# EAGLE design communication (EAGLE 6.1)
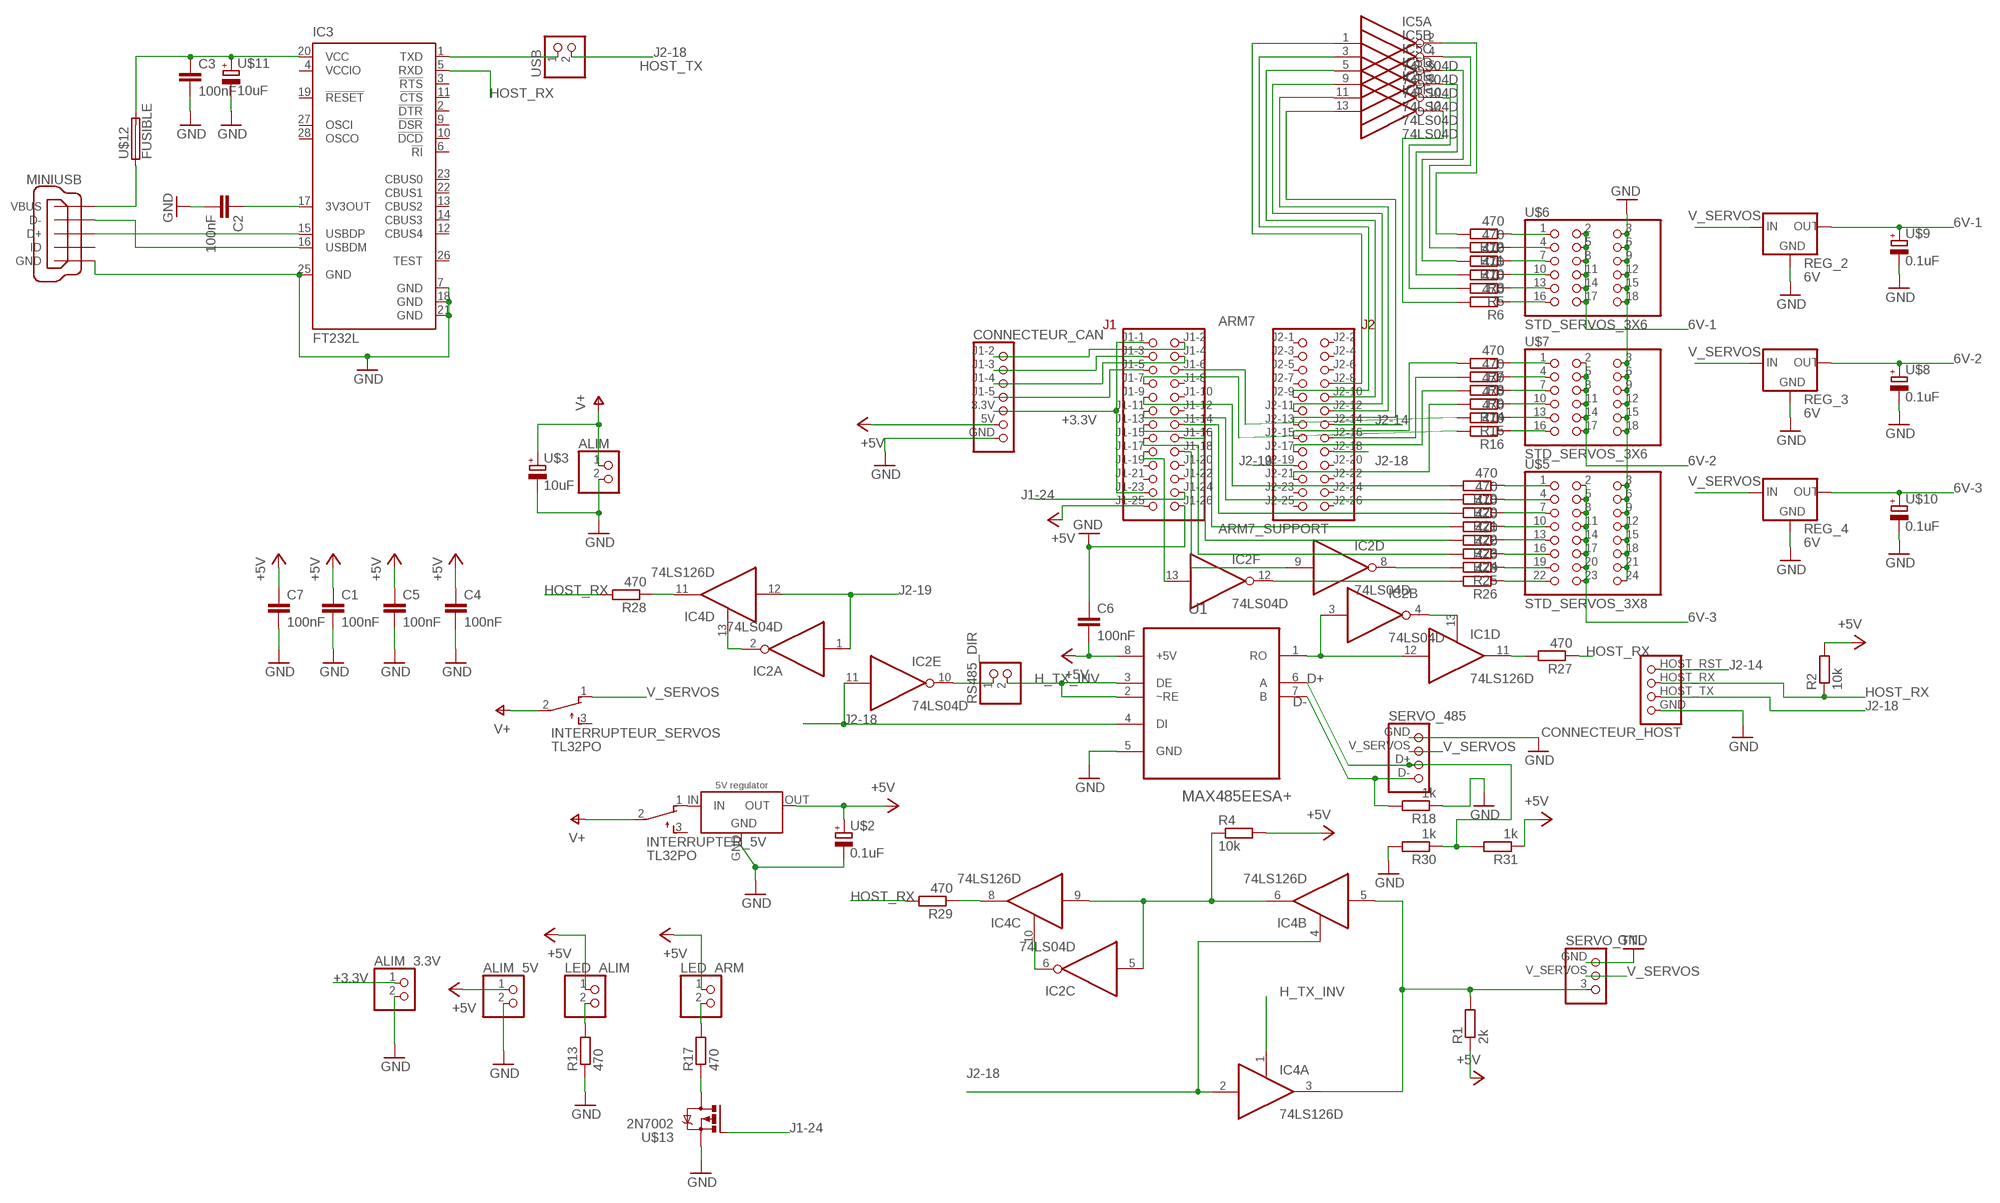
[diagram p0: schematic, sheet 1]

## Parts
ALIM  CONNEC_1X02  [CONNEC_1X02]
ALIM_3.3V  CONNEC_1X02  [CONNEC_1X02]
ALIM_5V  CONNEC_1X02  [CONNEC_1X02]
ARM7  ARM7_SUPPORT  [ARM7_SUPPORT]
C1  100nF  C_EU_1210  [C1210]
C2  100nF  C_EU_1210  [C1210]
C3  100nF  C_EU_1210  [C1210]
C4  100nF  C_EU_1210  [C1210]
C5  100nF  C_EU_1210  [C1210]
C6  100nF  C_EU_1210  [C1210]
C7  100nF  C_EU_1210  [C1210]
CONNECTEUR_CAN  CONNECTEUR_CAN  [CONNECTEUR_CAN]
CONNECTEUR_HOST  CONNECTEUR_HOST  [CONNECTEUR_HOST]
IC1  74LS126D  [SO14]
IC2  74LS04D  [SO14]
IC3  FT232L  [SSOP28]
IC4  74LS126D  [SO14]
IC5  74LS04D  [SO14]
INTERRUPTER_5V  TL32PO  [TL3XPO]
INTERRUPTEUR_SERVOS  TL32PO  [TL3XPO]
LED_ALIM  CONNEC_1X02  [CONNEC_1X02]
LED_ARM  CONNEC_1X02  [CONNEC_1X02]
MINIUSB  MINIUSB  [MINI_USB]
R1  2k  R-EU_R0805  [R0805]
R2  10k  R-EU_R0805  [R0805]
R3  470  R-EU_R0805  [R0805]
R4  10k  R-EU_R0805  [R0805]
R5  470  R-EU_R0805  [R0805]
R6  470  R-EU_R0805  [R0805]
R7  470  R-EU_R0805  [R0805]
R8  470  R-EU_R0805  [R0805]
R9  470  R-EU_R0805  [R0805]
R10  470  R-EU_R0805  [R0805]
R11  470  R-EU_R0805  [R0805]
R12  470  R-EU_R0805  [R0805]
R13  470  R-EU_R0805  [R0805]
R14  470  R-EU_R0805  [R0805]
R15  470  R-EU_R0805  [R0805]
R16  470  R-EU_R0805  [R0805]
R17  470  R-EU_R0805  [R0805]
R18  1k  R-EU_R0805  [R0805]
R19  470  R-EU_R0805  [R0805]
R20  470  R-EU_R0805  [R0805]
R21  470  R-EU_R0805  [R0805]
R22  470  R-EU_R0805  [R0805]
R23  470  R-EU_R0805  [R0805]
R24  470  R-EU_R0805  [R0805]
R25  470  R-EU_R0805  [R0805]
R26  470  R-EU_R0805  [R0805]
R27  470  R-EU_R0805  [R0805]
R28  470  R-EU_R0805  [R0805]
R29  470  R-EU_R0805  [R0805]
R30  1k  R-EU_R0805  [R0805]
R31  1k  R-EU_R0805  [R0805]
REG_2  6V  78XXL  [78XXL]
REG_3  6V  78XXL  [78XXL]
REG_4  6V  78XXL  [78XXL]
RS485_DIR  CONNEC_1X02  [CONNEC_1X02]
SERVO_485  CONNECTEUR_485  [CONNECTEUR_485]
SERVO_TTL  CONNECTEUR_TTL  [CONNECTEUR_TTL]
U1  MAX485EESA+  [SOIC127P600X175-8N]
U$2  0.1uF  CPOL_EUCPOL_EU_2.54-6  [E2,5-6]
U$3  10uF  CPOL_EUCPOL_EU_5-10,5  [E5-10,5]
U$5  STD_SERVOS_3X8  [STD_SERVOS_3X8]
U$6  STD_SERVOS_3X6  [STD_SERVOS_3X6]
U$7  STD_SERVOS_3X6  [STD_SERVOS_3X6]
U$8  0.1uF  CPOL_EUCPOL_EU_2.54-6  [E2,5-6]
U$9  0.1uF  CPOL_EUCPOL_EU_2.54-6  [E2,5-6]
U$10  0.1uF  CPOL_EUCPOL_EU_2.54-6  [E2,5-6]
U$11  10uF  CPOL_EUCPOL_EU_5-10,5  [E5-10,5]
U$12  FUSIBLE  [FUSIBLE]
U$13  2N7002  [SOT23]
U$14  5V regulator  REGULATEUR_CMS  [REGULATEUR_CMS]
USB  CONNEC_1X02  [CONNEC_1X02]

## Nets
6V-1: REG_2.OUT U$6.2 U$6.5 U$6.8 U$6.11 U$6.14 U$6.17 U$9.+
6V-2: REG_3.OUT U$7.2 U$7.5 U$7.8 U$7.11 U$7.14 U$7.17 U$8.+
6V-3: REG_4.OUT U$5.2 U$5.5 U$5.8 U$5.11 U$5.14 U$5.17 U$5.20 U$5.23 U$10.+
+3.3V: ALIM_3.3V.1 ARM7.J1-1 ARM7.J1-23 CONNECTEUR_CAN.3.3V
+5V: ALIM_5V.1 ARM7.J1-25 C1.1 C4.1 C5.1 C6.2 C7.1 CONNECTEUR_CAN.5V LED_ALIM.1 LED_ARM.1 R1.1 R2.2 R4.2 R31.1 U1.8(+5V) U$2.+ U$14.OUT
ALIM_USB: C3.1 IC3.20(VCC) U$11.+ U$12.P$2
B$1: ARM7.J2-8 IC5.1(A:I)
B$2: ARM7.J2-9 IC5.3(B:I)
B$3: ARM7.J2-10 IC5.5(C:I)
B$4: ARM7.J2-11 IC5.9(D:I)
B$5: ARM7.J2-12 IC5.11(E:I)
B$6: ARM7.J2-13 IC5.13(F:I)
B$7: ARM7.J2-15 R7.2
B$8: ARM7.J2-16 R8.2
B$9: ARM7.J2-17 R9.2
B$10: ARM7.J2-21 R14.2
B$11: ARM7.J1-6 R15.2
B$12: ARM7.J1-7 R16.2
D+: R30.1 R31.2 SERVO_485.D+ U1.6(A)
D-: R18.2 SERVO_485.D- U1.7(B)
GND: ALIM.2 ALIM_3.3V.2 ALIM_5V.2 ARM7.J1-26 C1.2 C2.2 C3.2 C4.2 C5.2 C6.1 C7.2 CONNECTEUR_CAN.GND CONNECTEUR_HOST.GND IC3.7(GND) IC3.18(GND) IC3.21(GND) IC3.25(GND) MINIUSB.GND R13.1 R18.1 R30.2 REG_2.GND REG_3.GND REG_4.GND SERVO_485.GND SERVO_TTL.GND U1.5(GND) U$2.- U$3.- U$5.3 U$5.6 U$5.9 U$5.12 U$5.15 U$5.18 U$5.21 U$5.24 U$6.3 U$6.6 U$6.9 U$6.12 U$6.15 U$6.18 U$7.3 U$7.6 U$7.9 U$7.12 U$7.15 U$7.18 U$8.- U$9.- U$10.- U$11.- U$13.2(S) U$14.GND
H_TX_INV: IC4.1(A:OE) RS485_DIR.2 U1.2(~RE) U1.3(DE)
HOST_RX: CONNECTEUR_HOST.HOST_RX IC3.5(RXD) R2.1 R27.1 R28.2 R29.2
J1-2: ARM7.J1-2 CONNECTEUR_CAN.J1-2
J1-3: ARM7.J1-3 CONNECTEUR_CAN.J1-3
J1-4: ARM7.J1-4 CONNECTEUR_CAN.J1-4
J1-5: ARM7.J1-5 CONNECTEUR_CAN.J1-5
J1-24: ARM7.J1-24 U$13.1(G)
J2-14: ARM7.J2-14 CONNECTEUR_HOST.HOST_RST
J2-18: ARM7.J2-18 CONNECTEUR_HOST.HOST_TX IC2.11(E:I) IC4.2(A:I) IC4.4(B:OE) U1.4(DI) USB.2
J2-19: ARM7.J2-19 IC2.1(A:I) IC4.12(D:I)
N$1: IC2.6(C:O) IC4.10(C:OE)
N$2: IC2.5(C:I) IC4.6(B:O) IC4.9(C:I) R4.1
N$3: INTERRUPTER_5V.1(O) U$14.IN
N$4: IC2.8(D:O) R25.2
N$5: IC4.3(A:O) IC4.5(B:I) R1.2 SERVO_TTL.3
N$6: LED_ALIM.2 R13.2
N$7: IC1.12(D:I) IC2.3(B:I) U1.1(RO)
N$8: IC2.12(F:O) R26.2
N$9: R17.1 U$13.3(D)
N$10: LED_ARM.2 R17.2
N$11: IC3.1(TXD) USB.1
N$12: IC1.13(D:OE) IC2.4(B:O)
N$13: ARM7.J1-9 R19.2
N$14: MINIUSB.VBUS U$12.P$1
N$15: IC2.2(A:O) IC4.13(D:OE)
N$16: R12.1 U$6.1
N$17: R11.1 U$6.4
N$18: R10.1 U$6.7
N$19: R3.1 U$6.10
N$20: R5.1 U$6.13
N$21: R6.1 U$6.16
N$22: R7.1 U$7.1
N$23: R8.1 U$7.4
N$24: R9.1 U$7.7
N$25: R14.1 U$7.10
N$26: R15.1 U$7.13
N$27: R16.1 U$7.16
N$28: ARM7.J1-11 R20.2
N$29: ARM7.J1-13 R22.2
N$30: ARM7.J1-14 R21.2
N$31: ARM7.J1-16 R23.2
N$32: ARM7.J1-15 R24.2
N$33: ARM7.J1-18 IC2.9(D:I)
N$34: ARM7.J1-17 IC2.13(F:I)
N$35: R19.1 U$5.1
N$36: R20.1 U$5.4
N$37: R21.1 U$5.7
N$38: R22.1 U$5.10
N$39: R23.1 U$5.13
N$40: R24.1 U$5.16
N$41: R25.1 U$5.19
N$42: R26.1 U$5.22
N$43: IC2.10(E:O) RS485_DIR.1
N$44: C2.1 IC3.17(3V3OUT)
N$45: IC3.15(USBDP) MINIUSB.D+
N$46: IC3.16(USBDM) MINIUSB.D-
N$49: IC5.12(F:O) R6.2
N$50: IC5.10(E:O) R5.2
N$51: IC5.8(D:O) R3.2
N$52: IC5.6(C:O) R10.2
N$53: IC5.4(B:O) R11.2
N$54: IC5.2(A:O) R12.2
TO_RX-1: IC1.11(D:O) R27.2
TO_RX-2: IC4.8(C:O) R29.1
TO_RX-3: IC4.11(D:O) R28.1
V+: ALIM.1 INTERRUPTER_5V.2(P) INTERRUPTEUR_SERVOS.2(P) U$3.+
V_SERVOS: INTERRUPTEUR_SERVOS.1(O) REG_2.IN REG_3.IN REG_4.IN SERVO_485.V_SERVOS SERVO_TTL.V_SERVOS
Unconnected: ARM7.J1-8 ARM7.J1-10 ARM7.J1-12 ARM7.J1-19 ARM7.J1-20 ARM7.J1-21 ARM7.J1-22 ARM7.J2-1 ARM7.J2-2 ARM7.J2-3 ARM7.J2-4 ARM7.J2-5 ARM7.J2-6 ARM7.J2-7 ARM7.J2-20 ARM7.J2-22 ARM7.J2-23 ARM7.J2-24 ARM7.J2-25 ARM7.J2-26 IC1.1(A:OE) IC1.2(A:I) IC1.3(A:O) IC1.4(B:OE) IC1.5(B:I) IC1.6(B:O) IC1.8(C:O) IC1.9(C:I) IC1.10(C:OE) IC3.2(!DTR) IC3.3(!RTS) IC3.6(!RI) IC3.9(!DSR) IC3.10(!DCD) IC3.11(!CTS) IC3.12(CBUS4) IC3.13(CBUS2) IC3.14(CBUS3) IC3.19(!RESET) IC3.22(CBUS1) IC3.23(CBUS0) IC3.26(TEST) IC3.27(OSCI) IC3.28(OSCO) INTERRUPTER_5V.3(S) INTERRUPTEUR_SERVOS.3(S) MINIUSB.ID

## Notes on the sheet
- HOST_TX

## Power pins joined to a net without a drawn wire
+5V: IC1.14(P:+5V) IC2.14(P:+5V) IC4.14(P:+5V) IC5.14(P:+5V)
GND: IC1.7(P:GND) IC2.7(P:GND) IC4.7(P:GND) IC5.7(P:GND) U$14.GND2(GND)
VCCIO: IC3.4(VCCIO)

## Library data of the parts
ALIM ALIM_3.3V ALIM_5V LED_ALIM LED_ARM RS485_DIR USB = rhoban:CONNEC_1X02
ARM7 = rhoban:ARM7_SUPPORT: The support used for the ARM7
C1-C7 = rhoban:C_EU_1210
CONNECTEUR_CAN = rhoban:CONNECTEUR_CAN
CONNECTEUR_HOST = rhoban:CONNECTEUR_HOST
IC1 IC4 = rhoban:74*126: Quad bus BUFFER, 3-state
IC2 IC5 = rhoban:74*04: Hex INVERTER
IC3 = rhoban:FT232: Source: http://www.ftdichip.com/Documents/DataSheets/DS_FT232R_v104.pdf; MPN: FT232RL; OC_FARNELL: 1146032; OC_NEWARK: 91K9918
INTERRUPTER_5V INTERRUPTEUR_SERVOS = rhoban:TL32PO
MINIUSB = rhoban:MINIUSB
R1-R31 = rhoban:R-EU_: RESISTOR, European symbol
REG_2-REG_4 = rhoban:78XXL: Régulateur de tension
SERVO_485 = rhoban:CONNECTEUR_485
SERVO_TTL = rhoban:CONNECTEUR_TTL
U1 = rhoban:MAX485EESA+; DESCRIPTION: ±15kV ESD-Protected, Slew-Rate-Limited, Low-Power, RS-485/RS-422 Transceivers; MPN: MAX485EESA+; OC_FARNELL: 1379973; OC_NEWARK: 68K4798; PACKAGE: SOIC-8; SUPPLIER: Maxim
U$2 U$3 U$8-U$11 = rhoban:CPOL_EU
U$5 = rhoban:STD_SERVOS_3X8
U$6 U$7 = rhoban:STD_SERVOS_3X6
U$12 = rhoban:FUSIBLE
U$13 = rhoban:2N7002
U$14 = rhoban:REGULATEUR_CMS

## Board
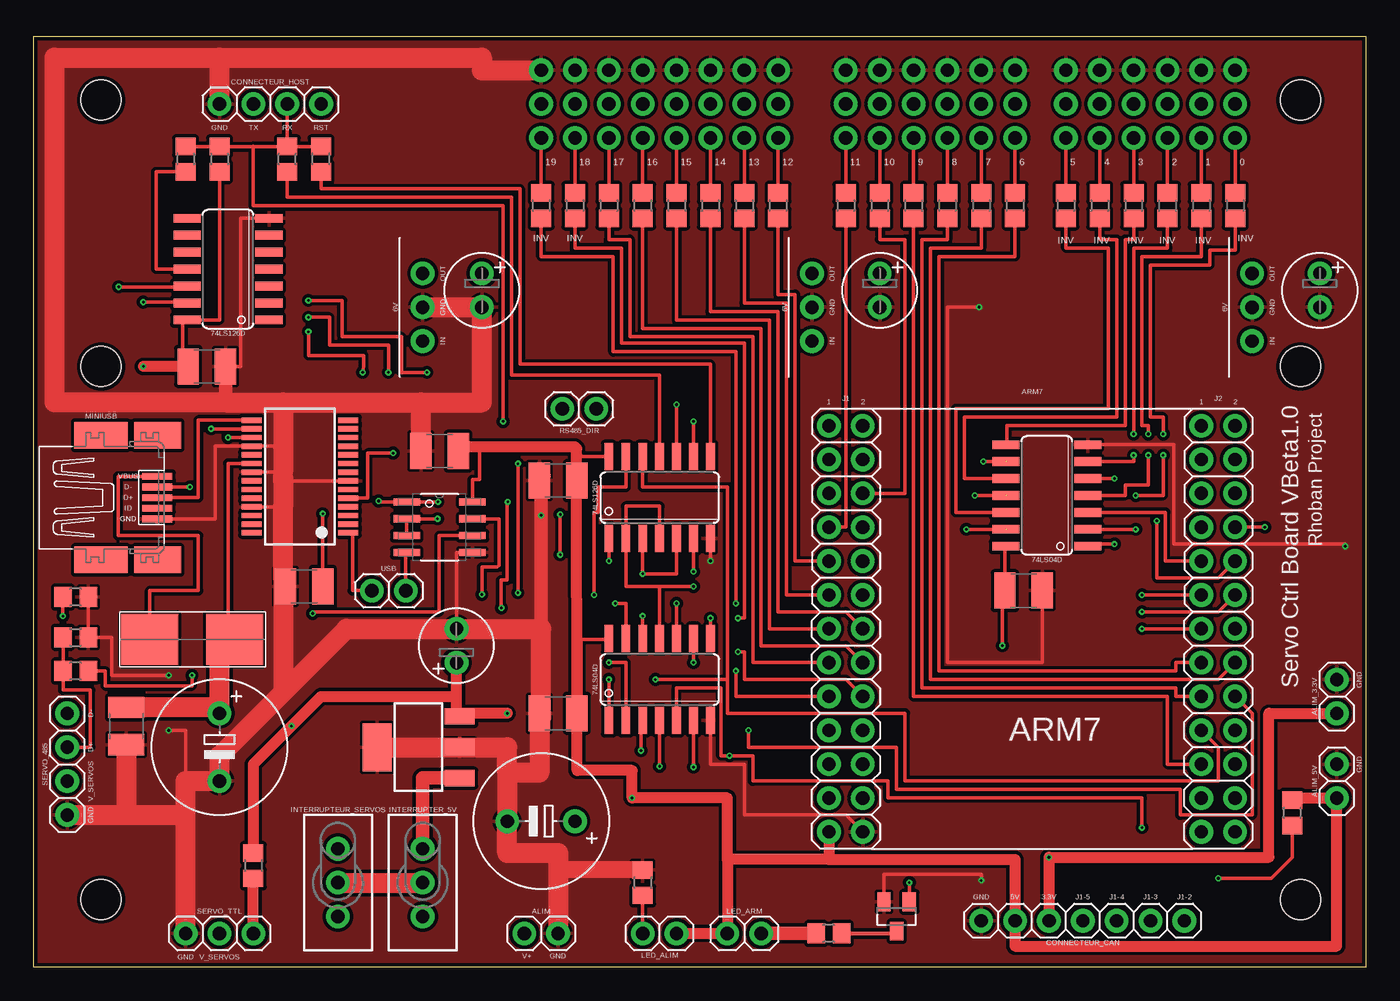
[diagram p1: board, top side]
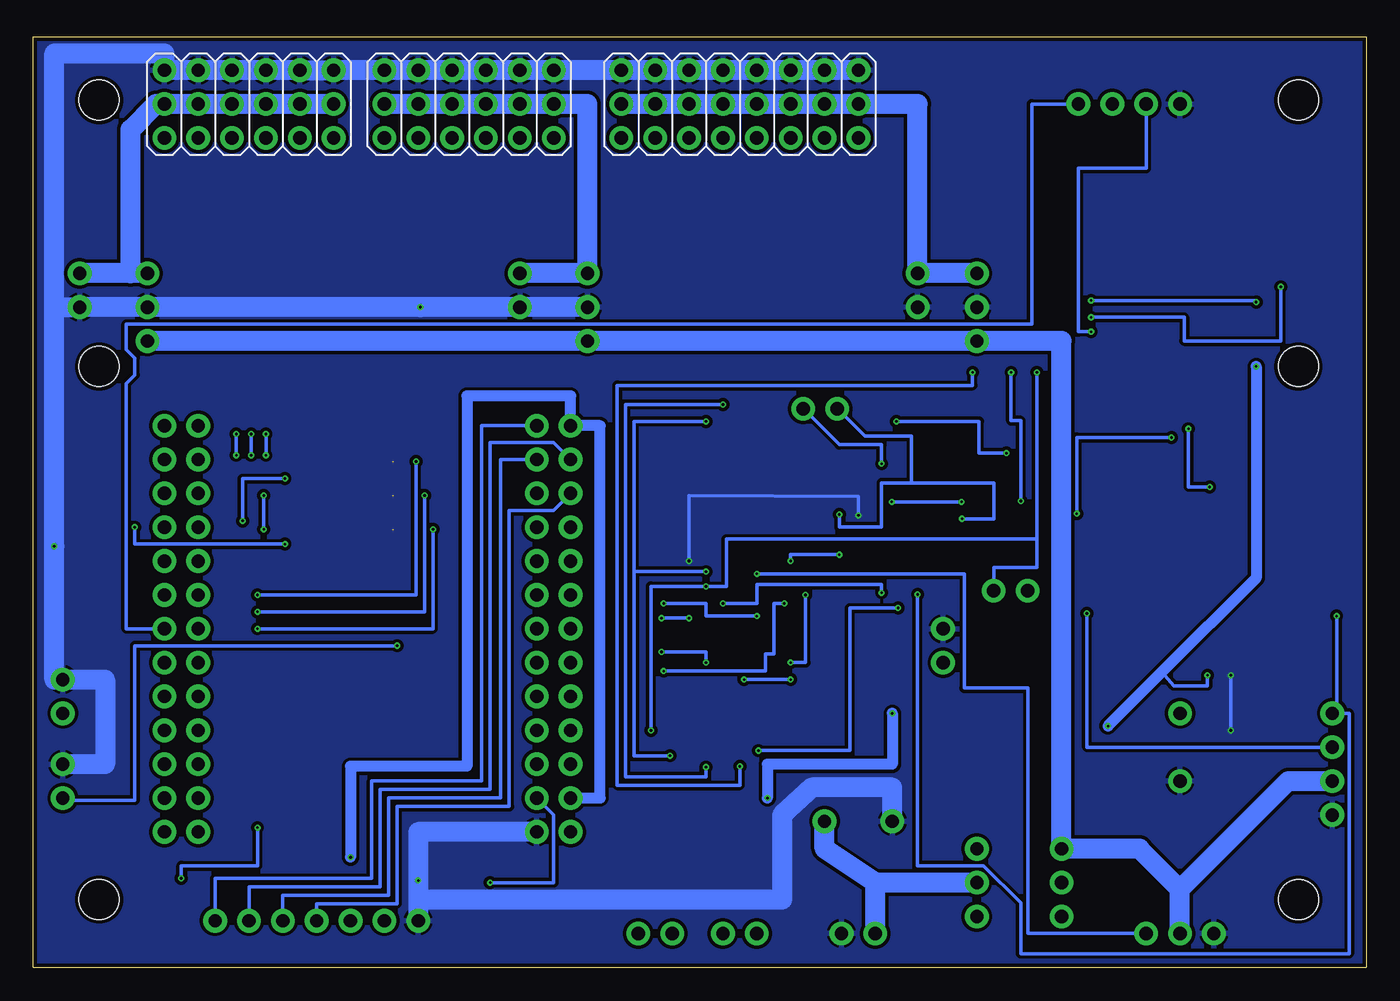
[diagram p2: board, bottom side, seen from below]

Size 100 x 69.85 mm. Coordinates in mm from the lower left corner, seen from the top.
Outline: 100,0.01 100,69.85 0,69.85 0,0.01
Outline: 100,0 0,0
Copper layers (1*16): Top 0.035mm / dielectric 1.5mm / Bottom 0.035mm
Design rules: minimum track width 0.125mm, minimum drill 0.2mm, track to track 0.125mm, track to pad 0.125mm, pad to pad 0.125mm, via to via 0.125mm, smd to smd 0.125mm, copper to edge 0.3mm, drill to drill 0.2mm, minimum pad ring 0.2mm, minimum via ring 0.125mm, stop-mask expansion 0.075mm, vias tented up to drill 0mil, thermal gap 0.2mm
Holes 3 mm at 5.08,5.09 95.07,5.09 5.08,45.09 95.07,45.09 5.08,65.08 95.07,65.08

### Footprints (pad centres in the part's own frame; a part is rotated, then mirrored left to right if it is on the bottom)
CONNEC_1X02 = drill 1 pad 1.778: 1 -1.27,1.27; 2 1.27,1.27
ARM7_SUPPORT = drill 1 pad 1.778: J1-1 1.27,1.27; J1-2 1.27,3.81; J1-3 3.81,1.27; J1-4 3.81,3.81; J1-5 6.35,1.27; J1-6 6.35,3.81; J1-7 8.89,1.27; J1-8 8.89,3.81; J1-9 11.43,1.27; J1-10 11.43,3.81; J1-11 13.97,1.27; J1-12 13.97,3.81; J1-13 16.51,1.27; J1-14 16.51,3.81; J1-15 19.05,1.27; J1-16 19.05,3.81; J1-17 21.59,1.27; J1-18 21.59,3.81; J1-19 24.13,1.27; J1-20 24.13,3.81; J1-21 26.67,1.27; J1-22 26.67,3.81; J1-23 29.21,1.27; J1-24 29.21,3.81; J1-25 31.75,1.27; J1-26 31.75,3.81; J2-1 1.27,29.21; J2-2 1.27,31.75; J2-3 3.81,29.21; J2-4 3.81,31.75; J2-5 6.35,29.21; J2-6 6.35,31.75; J2-7 8.89,29.21; J2-8 8.89,31.75; J2-9 11.43,29.21; J2-10 11.43,31.75; J2-11 13.97,29.21; J2-12 13.97,31.75; J2-13 16.51,29.21; J2-14 16.51,31.75; J2-15 19.05,29.21; J2-16 19.05,31.75; J2-17 21.59,29.21; J2-18 21.59,31.75; J2-19 24.13,29.21; J2-20 24.13,31.75; J2-21 26.67,29.21; J2-22 26.67,31.75; J2-23 29.21,29.21; J2-24 29.21,31.75; J2-25 31.75,29.21; J2-26 31.75,31.75
C1210 = smd 1.6 x 2.7: 1 -1.4,0; 2 1.4,0
CONNECTEUR_CAN = drill 1 pad 1.778: 3.3V 8.89,1.27; 5V 11.43,1.27; GND 13.97,1.27; J1-2 -1.27,1.27; J1-3 1.27,1.27; J1-4 3.81,1.27; J1-5 6.35,1.27
CONNECTEUR_HOST = drill 1 pad 1.778: GND -1.27,1.27; HOST_RST 6.35,1.27; HOST_RX 3.81,1.27; HOST_TX 1.27,1.27
SO14 = smd 0.66 x 2.032: 1 -3.81,-3.073; 2 -2.54,-3.073; 3 -1.27,-3.073; 4 0,-3.073; 5 1.27,-3.073; 6 2.54,-3.073; 7 3.81,-3.073; 8 3.81,3.073; 9 2.54,3.073; 10 1.27,3.073; 11 0,3.073; 12 -1.27,3.073; 13 -2.54,3.073; 14 -3.81,3.073
SSOP28 = smd 0.4 x 1.5: 1 -4.225,-3.625; 2 -3.575,-3.625; 3 -2.925,-3.625; 4 -2.275,-3.625; 5 -1.625,-3.625; 6 -0.975,-3.625; 7 -0.325,-3.625; 8 0.325,-3.625; 9 0.975,-3.625; 10 1.625,-3.625; 11 2.275,-3.625; 12 2.925,-3.625; 13 3.575,-3.625; 14 4.225,-3.625; 15 4.225,3.625; 16 3.575,3.625; 17 2.925,3.625; 18 2.275,3.625; 19 1.625,3.625; 20 0.975,3.625; 21 0.325,3.625; 22 -0.325,3.625; 23 -0.975,3.625; 24 -1.625,3.625; 25 -2.275,3.625; 26 -2.925,3.625; 27 -3.575,3.625; 28 -4.225,3.625
TL3XPO = drill 1 pad 1.778: 1 -1.27,0; 2 1.27,0; 3 3.81,0
MINI_USB = smd 2.25 x 0.5: D+ 4.225,0; D- 4.225,0.8; GND 4.225,-1.6; ID 4.225,-0.8; VBUS 4.225,1.6 | smd 4 x 2: M1 0,-4.671; M5 0,4.671 | smd 3.5 x 2: M3 4.25,4.671; M4 4.25,-4.671
R0805 = smd 1.3 x 1.5: 1 -0.95,0; 2 0.95,0
78XXL = drill 1 pad 1.778: GND 5.08,-2.54; IN 2.54,-2.54; OUT 7.62,-2.54
CONNECTEUR_485 = drill 1 pad 1.778: D+ 3.81,1.27; D- 6.35,1.27; GND -1.27,1.27; V_SERVOS 1.27,1.27
CONNECTEUR_TTL = drill 1 pad 1.778: 3 3.81,1.27; GND -1.27,1.27; V_SERVOS 1.27,1.27
SOIC127P600X175-8N = smd 1.981 x 0.533: 1 -2.464,1.905; 2 -2.464,0.635; 3 -2.464,-0.635; 4 -2.464,-1.905; 5 2.464,-1.905; 6 2.464,-0.635; 7 2.464,0.635; 8 2.464,1.905
E2,5-6 = drill 1 pad 1.778: + -1.27,0; - 1.27,0
E5-10,5 = drill 1 pad 1.778: + -2.54,0; - 2.54,0
STD_SERVOS_3X8 = drill 1 pad 1.778: 1 -8.89,-1.27; 2 -8.89,1.27; 3 -8.89,3.81; 4 -6.35,-1.27; 5 -6.35,1.27; 6 -6.35,3.81; 7 -3.81,-1.27; 8 -3.81,1.27; 9 -3.81,3.81; 10 -1.27,-1.27; 11 -1.27,1.27; 12 -1.27,3.81; 13 1.27,-1.27; 14 1.27,1.27; 15 1.27,3.81; 16 3.81,-1.27; 17 3.81,1.27; 18 3.81,3.81; 19 6.35,-1.27; 20 6.35,1.27; 21 6.35,3.81; 22 8.89,-1.27; 23 8.89,1.27; 24 8.89,3.81
STD_SERVOS_3X6 = drill 1 pad 1.778: 1 -6.35,-1.27; 2 -6.35,1.27; 3 -6.35,3.81; 4 -3.81,-1.27; 5 -3.81,1.27; 6 -3.81,3.81; 7 -1.27,-1.27; 8 -1.27,1.27; 9 -1.27,3.81; 10 1.27,-1.27; 11 1.27,1.27; 12 1.27,3.81; 13 3.81,-1.27; 14 3.81,1.27; 15 3.81,3.81; 16 6.35,-1.27; 17 6.35,1.27; 18 6.35,3.81
FUSIBLE = smd 4.242 x 3.81: P$1 0,0; P$2 6.375,0
SOT23 = smd 1 x 1.4: 1 -0.95,-1.1; 2 0.95,-1.1; 3 0,1.1
REGULATEUR_CMS = smd 1.219 x 2.235: GND 0,-3.099; IN -2.311,-3.099; OUT 2.311,-3.099 | smd 3.6 x 2.2: GND2 0,3.099

### Placement (x,y rotation side)
ALIM  38.1,1.28 0 top
ALIM_3.3V  99.06,20.33 90 top
ALIM_5V  99.06,13.98 90 top
ARM7  58.42,41.92 270 top
C1  13.02,45.09 0 top
C2  20.32,28.59 180 top
C3  6.99,18.11 270 top
C4  39.37,19.06 180 top
C5  39.37,36.52 180 top
C6  30.48,38.74 0 top
C7  74.3,28.27 0 top
CONNECTEUR_CAN  85.09,4.77 180 top
CONNECTEUR_HOST  15.24,63.51 0 top
IC1  14.61,52.4 90 top
IC2  46.99,21.6 0 top
IC3  20,36.84 90 top
IC4  46.99,35.25 0 top
IC5  76.04,35.41 90 top
INTERRUPTER_5V  29.21,7.63 270 top
INTERRUPTEUR_SERVOS  22.86,7.63 270 top
LED_ALIM  46.99,3.82 180 top
LED_ARM  53.34,1.28 0 top
MINIUSB  5.08,35.25 0 top
R1  16.51,7.63 270 top
R2  13.97,60.65 270 top
R3  82.55,57.16 270 top
R4  94.46,11.6 90 top
R5  80.01,57.16 270 top
R6  77.47,57.16 270 top
R7  73.66,57.16 270 top
R8  71.12,57.16 270 top
R9  68.58,57.16 270 top
R10  85.09,57.16 270 top
R11  87.63,57.16 270 top
R12  90.17,57.16 270 top
R13  45.72,6.36 270 top
R14  66.04,57.16 270 top
R15  63.5,57.16 270 top
R16  60.96,57.16 270 top
R17  59.69,2.55 180 top
R18  3.17,27.79 180 top
R19  55.88,57.16 270 top
R20  53.34,57.16 270 top
R21  50.8,57.16 270 top
R22  48.26,57.16 270 top
R23  45.72,57.16 270 top
R24  43.18,57.16 270 top
R25  40.64,57.16 270 top
R26  38.1,57.16 270 top
R27  11.43,60.65 270 top
R28  19.05,60.65 90 top
R29  21.59,60.65 90 top
R30  3.17,24.78 0 top
R31  3.17,22.24 180 top
REG_2  88.9,44.46 90 top
REG_3  55.88,44.46 90 top
REG_4  26.67,44.46 90 top
RS485_DIR  40.96,43.19 180 top
SERVO_485  3.81,12.71 90 top
SERVO_TTL  12.7,1.28 0 top
U1  30.48,33.03 0 top
U$2  31.75,24.14 90 top
U$3  38.1,10.96 180 top
U$5  46.99,63.51 0 bottom
U$6  83.82,63.51 0 bottom
U$7  67.31,63.51 0 bottom
U$8  63.5,50.81 270 top
U$9  96.52,50.81 270 top
U$10  33.66,50.81 270 top
U$11  13.97,16.52 270 top
U$12  8.73,24.62 0 top
U$13  64.77,3.82 180 top
U$14  28.89,16.52 90 top
USB  26.67,27 0 top

### Tracks (layer width: path | path; a pad name or v marks a point on that pad's centre or on a via)
6V-1
  Bottom 1.5: U$9.+ REG_2.OUT 92.71,52.08 92.71,62.88 90.81,64.78 U$6.2 U$6.5 U$6.8 U$6.11 U$6.14 U$6.17
6V-2
  Bottom 1.5: U$8.+ REG_3.OUT 58.42,64.78 U$7.17 U$7.14 U$7.11 U$7.8 U$7.5 U$7.2
6V-3
  Bottom 1.5: REG_4.OUT U$10.+ 33.66,64.78 U$5.23 U$5.20 U$5.17 U$5.14 U$5.11 U$5.8 U$5.5 U$5.2
+3.3V  (via drill 0.2 pad 0.41)
  Top 0.813: ALIM_3.3V.1 92.71,19.06 92.71,8.27 v76.2,8.27 CONNECTEUR_CAN.3.3V
  Bottom 0.813: ARM7.J1-23 57.47,12.71 57.47,40.65 ARM7.J1-1 59.69,42.87 67.47,42.87 67.47,15.09 76.2,15.09 v76.2,8.27
+5V  (via drill 0.2 pad 0.41)
  Top 0.254: R4.2 94.46,12.71 | IC2.14 43.18,24.62 40.8,24.62 | U1.8 32.94,36.6 33.5,36.6 33.5,39.06 32.94,39.06 | IC4.14 40.87,38.33 40.77,38.43 | C1.1 11.62,45.54 11.11,46.05 11.21,46.15 11.21,48.59 IC1.14 13.97,48.59 R2.2 | R1.1 16.51,8.9 | 32.38,18.93 32.38,19.06 | 40.77,19.38 40.8,21.92 | R31.1 5.4,22.24 5.4,21.12 11.91,21.12 v11.91,21.92 | IC5.14 72.89,31.6 C7.1 72.71,27.47 v72.71,24.14
  Top 0.813: 94.46,12.71 ALIM_5V.1 97.79,1.6 73.66,1.6 CONNECTEUR_CAN.5V 73.66,8.11 59.69,8.11 | 40.8,18.9 40.77,19.38 C4.1 40.8,18.56 40.8,14.77 44.93,14.77 v44.93,12.71 52.07,12.71 52.07,8.11 | 40.8,24.62 40.8,21.92 40.8,18.9 | 40.8,18.9 C5.1 40.77,38.43 40.77,38.93 40.64,39.06 32.94,39.06 31.88,39.06 C6.2 | C1.1 v8.26,45.09 | ARM7.J1-25 59.69,8.11 | 59.69,8.11 52.07,8.11 | 52.07,8.11 LED_ARM.1 LED_ALIM.1 | v35.56,19.06 32.38,19.06 31.99,19.06 | 31.75,20.33 31.75,19.06 31.99,19.06 | 31.75,20.33 U$2.+ | 31.75,20.33 21.59,20.33 v19.37,18.11 16.51,15.25 16.51,8.9 | 31.99,19.06 U$14.OUT
  Bottom 0.254: v11.91,21.92 11.91,21.12 14.45,21.12 15.32,22.16 | v72.71,24.14 92.39,24.14 92.39,12.55 97.79,12.55 ALIM_5V.1
  Bottom 0.813: v35.56,19.06 35.56,15.25 44.93,15.25 v44.93,12.71 | v8.26,45.09 8.26,29.22 15.32,22.16 v19.37,18.11
ALIM_USB
  Top 0.254: U$12.P$2 14.61,24.14 14.61,37.81 IC3.20
  Top 1.5: C3.1 13.97,19.51 U$11.+ 13.97,24.62 U$12.P$2
B$1  (via drill 0.2 pad 0.41)
  Top 0.254: v92.39,33.03 ARM7.J2-8 | v81.12,31.76 79.11,31.76 IC5.1
  Bottom 0.254: v92.39,33.03 92.39,31.76 v81.12,31.76
B$2
  Top 0.254: ARM7.J2-9 84.93,30.49 84.93,34.14 IC5.3
B$3  (via drill 0.2 pad 0.41)
  Top 0.254: ARM7.J2-10 88.9,29.22 84.3,29.22 v84.3,33.51 | v81.12,36.68 IC5.5
  Bottom 0.254: v84.3,33.51 84.3,36.68 v81.12,36.68
B$4  (via drill 0.2 pad 0.41)  (1 unrouted)
  Top 0.254: v83.19,27.95 ARM7.J2-11 | v71.28,37.95 73.03,37.95
  Bottom 0.254: v83.19,27.95 71.28,27.95 v71.28,37.95
B$5  (via drill 0.2 pad 0.41)  (1 unrouted)
  Top 0.254: v83.19,26.68 88.9,26.68 ARM7.J2-12 | v70.64,35.41 73.03,35.41
  Bottom 0.254: v83.19,26.68 70.64,26.68 v70.64,35.41
B$6  (via drill 0.2 pad 0.41)  (1 unrouted)
  Top 0.254: v83.19,25.41 ARM7.J2-13 | v70.01,32.87 73.03,32.87
  Bottom 0.254: v83.19,25.41 70.01,25.41 v70.01,32.87
B$7
  Top 0.254: R7.2 73.66,53.35 67.94,53.35 67.94,22.24 85.72,22.24 85.72,22.87 ARM7.J2-15
B$8
  Top 0.254: R8.2 71.12,53.98 67.31,53.98 67.31,21.6 88.9,21.6 ARM7.J2-16
B$9
  Top 0.254: R9.2 68.58,54.62 66.67,54.62 66.67,20.96 85.72,20.96 85.72,20.33 ARM7.J2-17
B$10
  Top 0.254: R14.2 66.04,20.33 85.09,20.33 85.09,15.25 ARM7.J2-21
B$11
  Top 0.254: R15.2 63.5,54.62 65.41,54.62 65.41,35.57 ARM7.J1-6
B$12
  Top 0.254: R16.2 60.96,33.03 ARM7.J1-7
D+  (via drill 0.2 pad 0.41)
  Top 0.254: U1.6 30.45,32.39 30.45,26.68 20.95,26.68 v20.95,26.55 | R30.1 R31.2 2.23,20.81 4.29,20.81 4.29,16.52 SERVO_485.D+
  Bottom 0.254: v20.95,26.55 20.95,16.52 SERVO_485.D+
D-  (via drill 0.2 pad 0.41)
  Top 0.254: U1.7 34.92,33.66 34.92,30.17 34.8,30.05 33.66,30.05 v33.66,27.98 | R18.2 2.22,27.95 v2.22,26.36
  Bottom 0.254: v33.66,27.98 33.66,7.63 28.7,7.63 25.91,4.84 25.91,1.03 1.27,1.03 1.27,19.06 SERVO_485.D- 2.22,19.38 v2.22,26.36
GND  (via drill 0.2 pad 0.41)
  Top 0.254: ARM7.J1-26 60.96,11.44 53.34,11.44 53.34,15.25 50.8,15.25 IC2.7 | 18.73,34.56 18.41,34.62 | 18.41,34.62 18.73,34.62 19.05,34.62 | 14.45,45.09 15.56,45.09 15.56,56.21 IC1.7 | U1.5 31.75,31.12 U$2.- | v38.1,33.92 38.09,36.91 | IC4.7 v50.8,30.49 | MINIUSB.GND 13.65,33.65 13.65,39.11 IC3.18 18.73,39.11 18.73,39.06 | IC3.7 18.73,36.52 | 18.73,37.16 IC3.21 | IC3.25 18.41,34.56 18.41,34.62 | U$13.2 63.82,7 71.12,7 v71.12,6.52 | R18.1 R30.2 5.87,24.78 5.87,21.92 v10.16,21.92 | v10.16,17.79 11.43,17.79 11.43,13.98 | C7.2 75.72,27.47 75.72,22.87 68.58,22.87 68.58,49.54 v70.96,49.54 | IC5.7 85.57,39.22 85.57,31.76 98.42,31.76 v98.42,31.6
  Top 0.305: 18.73,37.16 18.73,36.83
  Top 1.016: 38.09,36.91 38.1,25.41 | 14.45,45.09 14.45,42.4
  Top 1.27: R13.1 39.37,7.31 39.37,8.58
  Top 1.5: REG_4.GND U$10.- 33.66,42.4 29.08,42.4 | 18.73,36.83 18.73,36.52 18.73,34.62 18.73,34.56 18.73,29.22 | 18.73,42.4 14.45,42.4 1.59,42.4 1.59,68.27 13.97,68.27 | 18.73,42.4 18.73,39.06 18.73,37.16 | 18.73,20.65 13.97,15.88 U$11.- 11.43,13.98 11.43,11.44 | 18.73,20.65 23.5,25.41 U$2.- 38.1,25.41 38.1,19.06 | 18.73,29.22 18.73,20.65 | 35.56,14.62 37.97,14.62 C4.2 38.1,19.06 | 38.1,19.06 38.1,18.74 | C5.2 38.09,36.91 | C2.2 18.73,29.22 | C1.2 14.45,45.09 | 18.73,42.4 29.08,42.4 | C6.1 29.08,42.4 | SERVO_485.GND 6.99,11.44 | C3.2 6.99,11.44 | 6.99,11.44 11.43,11.44 | 35.56,14.62 U$3.- 35.56,8.58 39.37,8.58 ALIM.2 | 35.56,14.62 35.56,16.52 U$14.GND U$14.GND2 | CONNECTEUR_HOST.GND 13.97,68.27 | 13.97,68.27 33.66,68.27 33.66,67.32 U$5.24 | SERVO_TTL.GND 11.43,11.44
  Bottom 0.254: v38.1,33.92 38.1,35.35 50.8,35.41 v50.8,30.49 | v10.16,21.92 v10.16,17.79
  Bottom 1.5: REG_3.GND U$8.- v70.96,49.54 REG_2.GND U$9.- 98.42,49.54 | 98.42,49.54 v98.42,31.6 98.42,21.6 ALIM_3.3V.2 94.61,21.6 94.61,15.25 ALIM_5V.2 | 98.42,49.54 98.42,68.59 90.17,68.59 U$6.3 U$6.6 U$6.9 U$6.12 U$6.15 U$6.18 U$7.3 U$7.6 U$7.9 U$7.12 U$7.15 U$7.18 U$5.3 U$5.6 U$5.9 U$5.12 U$5.15 U$5.18 U$5.21 U$5.24 | U$3.- 35.56,13.5 41.59,13.5 43.81,11.44 43.81,5.09 71.12,5.09 | ARM7.J1-26 71.12,10.17 v71.12,6.52 71.12,5.09 | 71.12,5.09 CONNECTEUR_CAN.GND
  pour Bottom (isolate 0.254): 0.32,69.54 99.69,69.54 99.69,0.33 0.32,0.33
  pour Top (isolate 0.254): -0.32,70.18 -0.32,-0.31 100.33,-0.31 100.33,70.18
H_TX_INV  (via drill 0.2 pad 0.41)
  Top 0.254: U1.2 U1.3 28.02,33.58 28.1,33.66 v30.32,33.66 | v39.53,33.98 v39.53,30.97 | v43.18,30.49 IC4.1
  Bottom 0.254: v30.32,33.66 27.94,33.66 27.94,36.36 34.13,36.36 | RS485_DIR.2 37.62,39.86 34.13,39.86 34.13,36.36 | 34.13,36.36 36.35,36.36 36.35,33.03 39.53,33.03 v39.53,33.98 | v39.53,30.97 43.18,30.97 v43.18,30.49
HOST_RX  (via drill 0.2 pad 0.41)
  Top 0.254: R28.2 CONNECTEUR_HOST.HOST_RX | R27.1 R2.1 R28.2 | R28.2 R29.2 16.51,61.6 16.51,57.16 35.24,57.16 v35.24,40.97 | v26.99,38.59 25.08,38.59 25.08,35.21 IC3.5
  Bottom 0.254: v26.99,38.59 29.05,38.59 29.05,40.97 v35.24,40.97
J1-2
  Bottom 0.254: CONNECTEUR_CAN.J1-2 86.36,6.68 74.61,6.68 74.61,13.98 66.36,13.98 66.36,40.65 ARM7.J1-2
J1-3
  Bottom 0.254: CONNECTEUR_CAN.J1-3 83.82,6.04 73.98,6.04 73.98,13.35 65.72,13.35 65.72,39.22 65.72,39.38 60.96,39.38 ARM7.J1-3
J1-4
  Bottom 0.254: CONNECTEUR_CAN.J1-4 81.28,5.41 73.34,5.41 73.34,12.71 64.93,12.71 64.93,38.11 ARM7.J1-4
J1-5
  Bottom 0.254: CONNECTEUR_CAN.J1-5 78.74,4.77 72.71,4.77 72.71,12.07 64.29,12.07 64.29,34.3 60.96,34.3 ARM7.J1-5
J1-24  (via drill 0.2 pad 0.41)
  Top 0.254: v65.72,6.36 65.72,4.93 U$13.1
  Bottom 0.254: ARM7.J1-24 60.96,11.44 60.96,6.36 v65.72,6.36
J2-14
  Bottom 0.254: ARM7.J2-14 93.03,25.41 93.03,43.82 92.39,44.46 92.39,45.73 93.03,46.36 93.03,48.27 25.08,48.27 25.08,64.78 CONNECTEUR_HOST.HOST_RST
J2-18  (via drill 0.2 pad 0.41)
  Top 0.254: ARM7.J2-18 91.44,19.06 91.44,11.44 86.04,11.44 86.04,13.35 64.77,13.35 64.77,16.52 53.66,16.52 v53.66,17.79 | USB.2 27.94,31.12 U1.4 | IC4.4 46.99,34.62 44.45,34.62 IC4.2 44.45,28.59 46.99,28.59 | 46.99,28.59 IC2.11 | v24.7,44.65 24.77,45.09 24.77,45.92 20.64,45.92 v20.64,47.7 | v49.53,28.59 46.99,28.59
  Bottom 0.254: v53.66,17.79 53.66,28.59 v49.53,28.59 48.01,28.59 48.01,32.14 24.7,32.14 | CONNECTEUR_HOST.HOST_TX 16.51,59.95 21.59,59.95 21.59,47.7 v20.64,47.7 | 24.7,32.14 24.7,30.01 27.94,30.01 USB.2 | 24.7,32.14 v24.7,44.65
J2-19  (via drill 0.2 pad 0.41)
  Top 0.254: ARM7.J2-19 88.9,16.52 88.9,13.98 65.41,13.98 65.41,19.06 52.07,19.06 52.07,21.6 | IC4.12 45.72,36.05 52.07,36.05 52.07,21.6 | IC2.1 v43.18,21.6 | v46.67,21.6 52.07,21.6
  Bottom 0.254: v43.18,21.6 v46.67,21.6
N$1  (via drill 0.2 pad 0.41)
  Top 0.254: v49.53,15.03 IC2.6 | IC4.10 v48.26,42.24
  Bottom 0.254: v49.53,15.03 49.53,14.3 55.56,14.3 55.56,42.24 v48.26,42.24
N$2  (via drill 0.2 pad 0.41)
  Top 0.254: R4.1 94.46,8.27 92.87,6.68 v88.9,6.68 | v83.19,10.49 83.19,12.71 64.14,12.71 64.14,13.98 53.98,13.98 53.98,15.88 v52.23,15.88 51.59,15.88 51.59,20.96 48.26,20.96 IC2.5 | IC4.6 v49.53,29.7 | v49.53,40.97 IC4.9
  Bottom 0.254: v83.19,10.49 83.19,7.63 88.9,7.63 v88.9,6.68 | v49.53,29.7 54.93,29.7 | 54.93,29.7 54.93,15.88 v52.23,15.88 | v49.53,40.97 54.93,40.97 54.93,29.7
N$3
  Top 1.016: U$14.IN 29.21,14.21 INTERRUPTER_5V.1
N$4  (via drill 0.2 pad 0.41)
  Top 0.254: IC2.8 v50.8,26.2 | v52.86,26.2 53.34,26.2 53.34,46.84 44.13,46.84 44.13,53.98 40.64,53.98 R25.2
  Bottom 0.254: v50.8,26.2 v52.86,26.2
N$5  (via drill 0.2 pad 0.41)
  Top 0.254: IC4.3 v45.72,29.54 48.26,29.54 IC4.5 | 16.51,6.74 R1.2 16.51,6.36
  Top 0.813: SERVO_TTL.3 16.51,6.36
  Bottom 0.254: v45.72,29.54 30.16,29.54 30.16,20.96 25.4,20.96 25.4,2.55 SERVO_TTL.3
N$6
  Top 0.254: LED_ALIM.2 R13.2
N$7  (via drill 0.2 pad 0.41)
  Top 0.254: v30.35,34.93 U1.1 25.91,34.93 v25.91,35 | v35.12,26.97 35.08,26.97 35.08,29.06 35.56,29.06 35.56,34.93 v35.59,34.93 | v45.59,16.27 45.59,18.3 45.72,18.43 IC2.3 | v6.41,51.06 11.3,51.06 IC1.12 | v26.64,44.65 26.64,46.68 22.23,46.68 22.23,48.78 v20.64,48.78
  Bottom 0.254: v35.12,26.97 38.73,26.97 38.73,16.27 v45.59,16.27 | v6.41,51.06 6.41,47 13.65,47 13.65,48.78 v20.64,48.78 | v26.64,44.65 26.64,41.03 25.91,41.03 v25.91,35 | v30.35,34.93 v35.59,34.93
N$8  (via drill 0.2 pad 0.41)
  Top 0.254: IC2.12 v45.72,26.36 | v52.7,27.32 52.7,46.21 43.5,46.21 43.5,53.35 38.1,53.35 R26.2
  Bottom 0.254: v45.72,26.36 49.53,26.36 49.53,27.32 v52.7,27.32
N$9
  Top 0.305: U$13.3 64.6,2.55 R17.1
N$10
  Top 0.254: 58.8,2.55 R17.2 58.57,2.55
  Top 1.016: LED_ARM.2 58.57,2.55
N$11
  Top 0.254: USB.1 23.95,28.27 23.95,32.61 IC3.1
N$12  (via drill 0.2 pad 0.41)
  Top 0.254: v8.26,49.92 11.18,49.92 IC1.13 | v29.53,44.65 27.62,44.65 27.62,47.32 23.18,47.32 23.18,50.05 v20.64,50.05 | IC2.4 v46.99,15.09
  Bottom 0.254: v8.26,49.92 8.26,50.05 v20.64,50.05 | v29.53,44.65 29.53,43.67 56.2,43.67 56.2,13.66 46.99,13.66 v46.99,15.09
N$13
  Top 0.254: R19.2 55.88,50.49 57.15,50.49 57.15,30.49 ARM7.J1-9
N$14
  Top 0.254: U$12.P$1 8.73,28.27 12.38,28.27 12.38,32.39 6.35,32.39 6.35,36.85 MINIUSB.VBUS
N$15  (via drill 0.2 pad 0.41)
  Top 0.254: IC2.2 44.45,22.87 v43.18,22.87 | v42.07,27.95 42.07,34.14 42.39,34.14 42.39,36.05 44.45,36.05 44.45,38.27
  Top 0.406: IC4.13 44.45,38.27
  Bottom 0.254: v43.18,22.87 42.07,22.87 v42.07,27.95
N$16
  Top 0.254: R12.1 U$6.1
N$17
  Top 0.254: R11.1 U$6.4
N$18
  Top 0.254: R10.1 U$6.7
N$19
  Top 0.254: R3.1 U$6.10
N$20
  Top 0.254: R5.1 U$6.13
N$21
  Top 0.254: R6.1 U$6.16
N$22
  Top 0.254: R7.1 U$7.1
N$23
  Top 0.254: R8.1 U$7.4
N$24
  Top 0.254: R9.1 U$7.7
N$25
  Top 0.254: R14.1 U$7.10
N$26
  Top 0.254: R15.1 U$7.13
N$27
  Top 0.254: R16.1 U$7.16
N$28
  Top 0.254: R20.2 53.34,49.86 56.52,49.86 56.52,27.95 ARM7.J1-11
N$29
  Top 0.254: R22.2 48.26,48.59 55.24,48.59 55.24,25.41 ARM7.J1-13
N$30
  Top 0.254: R21.2 50.8,49.22 55.88,49.22 55.88,26.68 60.96,26.68 ARM7.J1-14
N$31
  Top 0.254: R23.2 45.72,47.95 54.61,47.95 54.61,24.14 60.96,24.14 ARM7.J1-16
N$32
  Top 0.254: R24.2 43.18,54.62 44.77,54.62 44.77,47.32 53.98,47.32 53.98,22.87 ARM7.J1-15
N$33  (via drill 0.2 pad 0.41)
  Top 0.254: ARM7.J1-18 60.96,21.6 53.34,21.6 53.34,23.66 v52.86,23.66 | v49.53,22.87 IC2.9
  Bottom 0.254: v52.86,23.66 49.53,23.66 v49.53,22.87
N$34  (via drill 0.2 pad 0.41)
  Top 0.254: ARM7.J1-17 52.7,20.33 v52.7,22.24 | v43.66,27.32 44.45,27.32 IC2.13
  Bottom 0.254: v52.7,22.24 45.09,22.24 45.09,23.51 44.45,23.51 44.45,27.32 v43.66,27.32
N$35
  Top 0.254: R19.1 U$5.1
N$36
  Top 0.254: R20.1 U$5.4
N$37
  Top 0.254: R21.1 U$5.7
N$38
  Top 0.254: R22.1 U$5.10
N$39
  Top 0.254: R23.1 U$5.13
N$40
  Top 0.254: R24.1 U$5.16
N$41
  Top 0.254: R25.1 U$5.19
N$42
  Top 0.254: R26.1 U$5.22
N$43  (via drill 0.2 pad 0.41)
  Top 0.254: IC2.10 v48.26,27.32 | v36.35,28.11 v36.35,37.79
  Bottom 0.254: v48.26,27.32 45.72,27.32 45.72,28.74 36.35,28.74 v36.35,28.11 | v36.35,37.79 36.35,39.22 39.53,39.22 RS485_DIR.1
N$44  (via drill 0.2 pad 0.41)
  Top 0.254: v21.72,34.05 21.72,29.22 C2.1 | IC3.17 v14.61,39.76
  Bottom 0.254: v21.72,34.05 21.72,39.76 v14.61,39.76
N$45
  Top 0.254: MINIUSB.D+ 12.38,35.25 12.38,41.06 IC3.15
N$46  (via drill 0.2 pad 0.41)
  Top 0.254: MINIUSB.D- v11.75,36.05 | IC3.16 v13.34,40.41
  Bottom 0.254: v11.75,36.05 13.34,36.05 v13.34,40.41
N$49
  Top 0.254: IC5.12 69.22,34.14 69.22,41.92 80.64,41.92 80.64,53.98 77.47,53.98 R6.2
N$50
  Top 0.254: IC5.10 69.85,36.68 69.85,41.28 81.28,41.28 81.28,54.62 80.01,54.62 R5.2
N$51
  Top 0.254: IC5.8 73.03,39.22 73.03,40.65 81.92,40.65 81.92,54.62 82.55,54.62 R3.2
N$52  (via drill 0.2 pad 0.41)
  Top 0.254: IC5.6 82.55,37.95 v82.55,38.43 | v82.55,40.02 82.55,53.98 85.09,53.98 R10.2
  Bottom 0.254: v82.55,38.43 v82.55,40.02
N$53  (via drill 0.2 pad 0.41)
  Top 0.254: IC5.4 81.92,35.41 81.92,36.2 83.66,36.2 v83.66,38.43 | v83.66,40.02 83.66,40.65 83.19,40.65 83.19,53.35 87.63,53.35 R11.2
  Bottom 0.254: v83.66,38.43 v83.66,40.02
N$54  (via drill 0.2 pad 0.41)
  Top 0.254: IC5.2 v82.71,32.87 | v82.71,35.41 84.77,35.41 v84.77,38.43 | v84.77,40.02 84.77,41.28 83.82,41.28 83.82,52.71 88.27,52.71 88.27,53.83 90.17,53.83 R12.2
  Bottom 0.254: v82.71,32.87 v82.71,35.41 | v84.77,38.43 v84.77,40.02
TO_RX-1
  Top 0.254: IC1.11 9.21,52.4 9.21,58.43 9.21,59.7 R27.2
TO_RX-2
  Top 0.254: R29.1 21.59,58.43 36.51,58.43 36.51,45.25 50.8,45.25 IC4.8
TO_RX-3
  Top 0.254: IC4.11 46.99,44.46 35.88,44.46 35.88,57.79 19.05,57.79 R28.1
V+
  Top 1.5: INTERRUPTEUR_SERVOS.2 INTERRUPTER_5V.2
  Bottom 1.5: INTERRUPTER_5V.2 36.83,6.36 | ALIM.1 36.83,6.36 | 36.83,6.36 40.64,8.9 U$3.+
V_SERVOS
  Bottom 1.5: REG_2.IN REG_3.IN REG_4.IN 22.86,47 INTERRUPTEUR_SERVOS.1 17.02,8.9 13.97,5.85 | 13.97,5.85 5.84,13.98 SERVO_485.V_SERVOS | SERVO_TTL.V_SERVOS 13.97,5.85

### Text on the board
tNames: 19 | 18 | 17 | 16 | 15 | 14 | 13 | 12 | 11 | 10 | 9 | 8 | 7 | 6 | 5 | 4 | 3 | 2 | 1 | 0 | INV | INV | INV | INV | INV | INV | INV | INV | Rhoban Project | Servo Ctrl Board VBeta1.0 | GND | ARM7 | GND | V+ | GND